# Altium schematic sheet RF.SchDoc
size A4; SheetNumber: 7; SheetTotal: 10
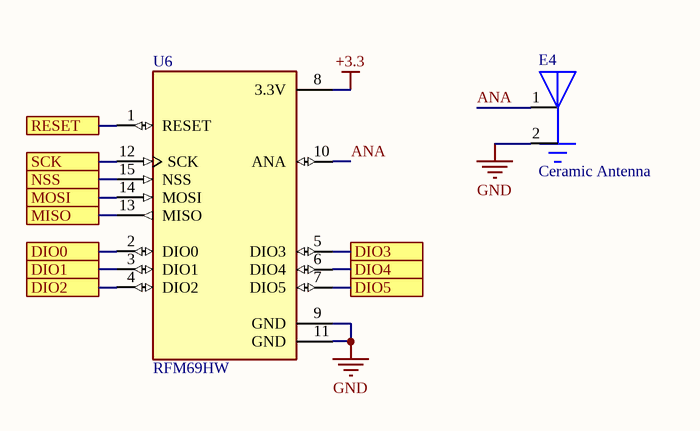
[diagram p0: RF.SchDoc]

## Parts
E4  Ceramic Antenna  [Ceramic_915M]
U6  RFM69HW  [RFM69HW]

## Ports
DIO0, DIO1, DIO2, DIO3, DIO4, DIO5, MISO, MOSI, NSS, RESET, SCK

## Nets
+3.3: U6.8(3.3V)
GND: E4.2 U6.9(GND) U6.11(GND)
ANA: E4.1 U6.10(ANA)
DIO0: U6.2(DIO0) ; port DIO0
DIO1: U6.3(DIO1) ; port DIO1
DIO2: U6.4(DIO2) ; port DIO2
DIO3: U6.5(DIO3) ; port DIO3
DIO4: U6.6(DIO4) ; port DIO4
DIO5: U6.7(DIO5) ; port DIO5
MISO: U6.13(MISO) ; port MISO
MOSI: U6.14(MOSI) ; port MOSI
NSS: U6.15(NSS) ; port NSS
RESET: U6.1(RESET) ; port RESET
SCK: U6.12(SCK) ; port SCK